# Altium schematic sheet MCU.SchDoc
size A2
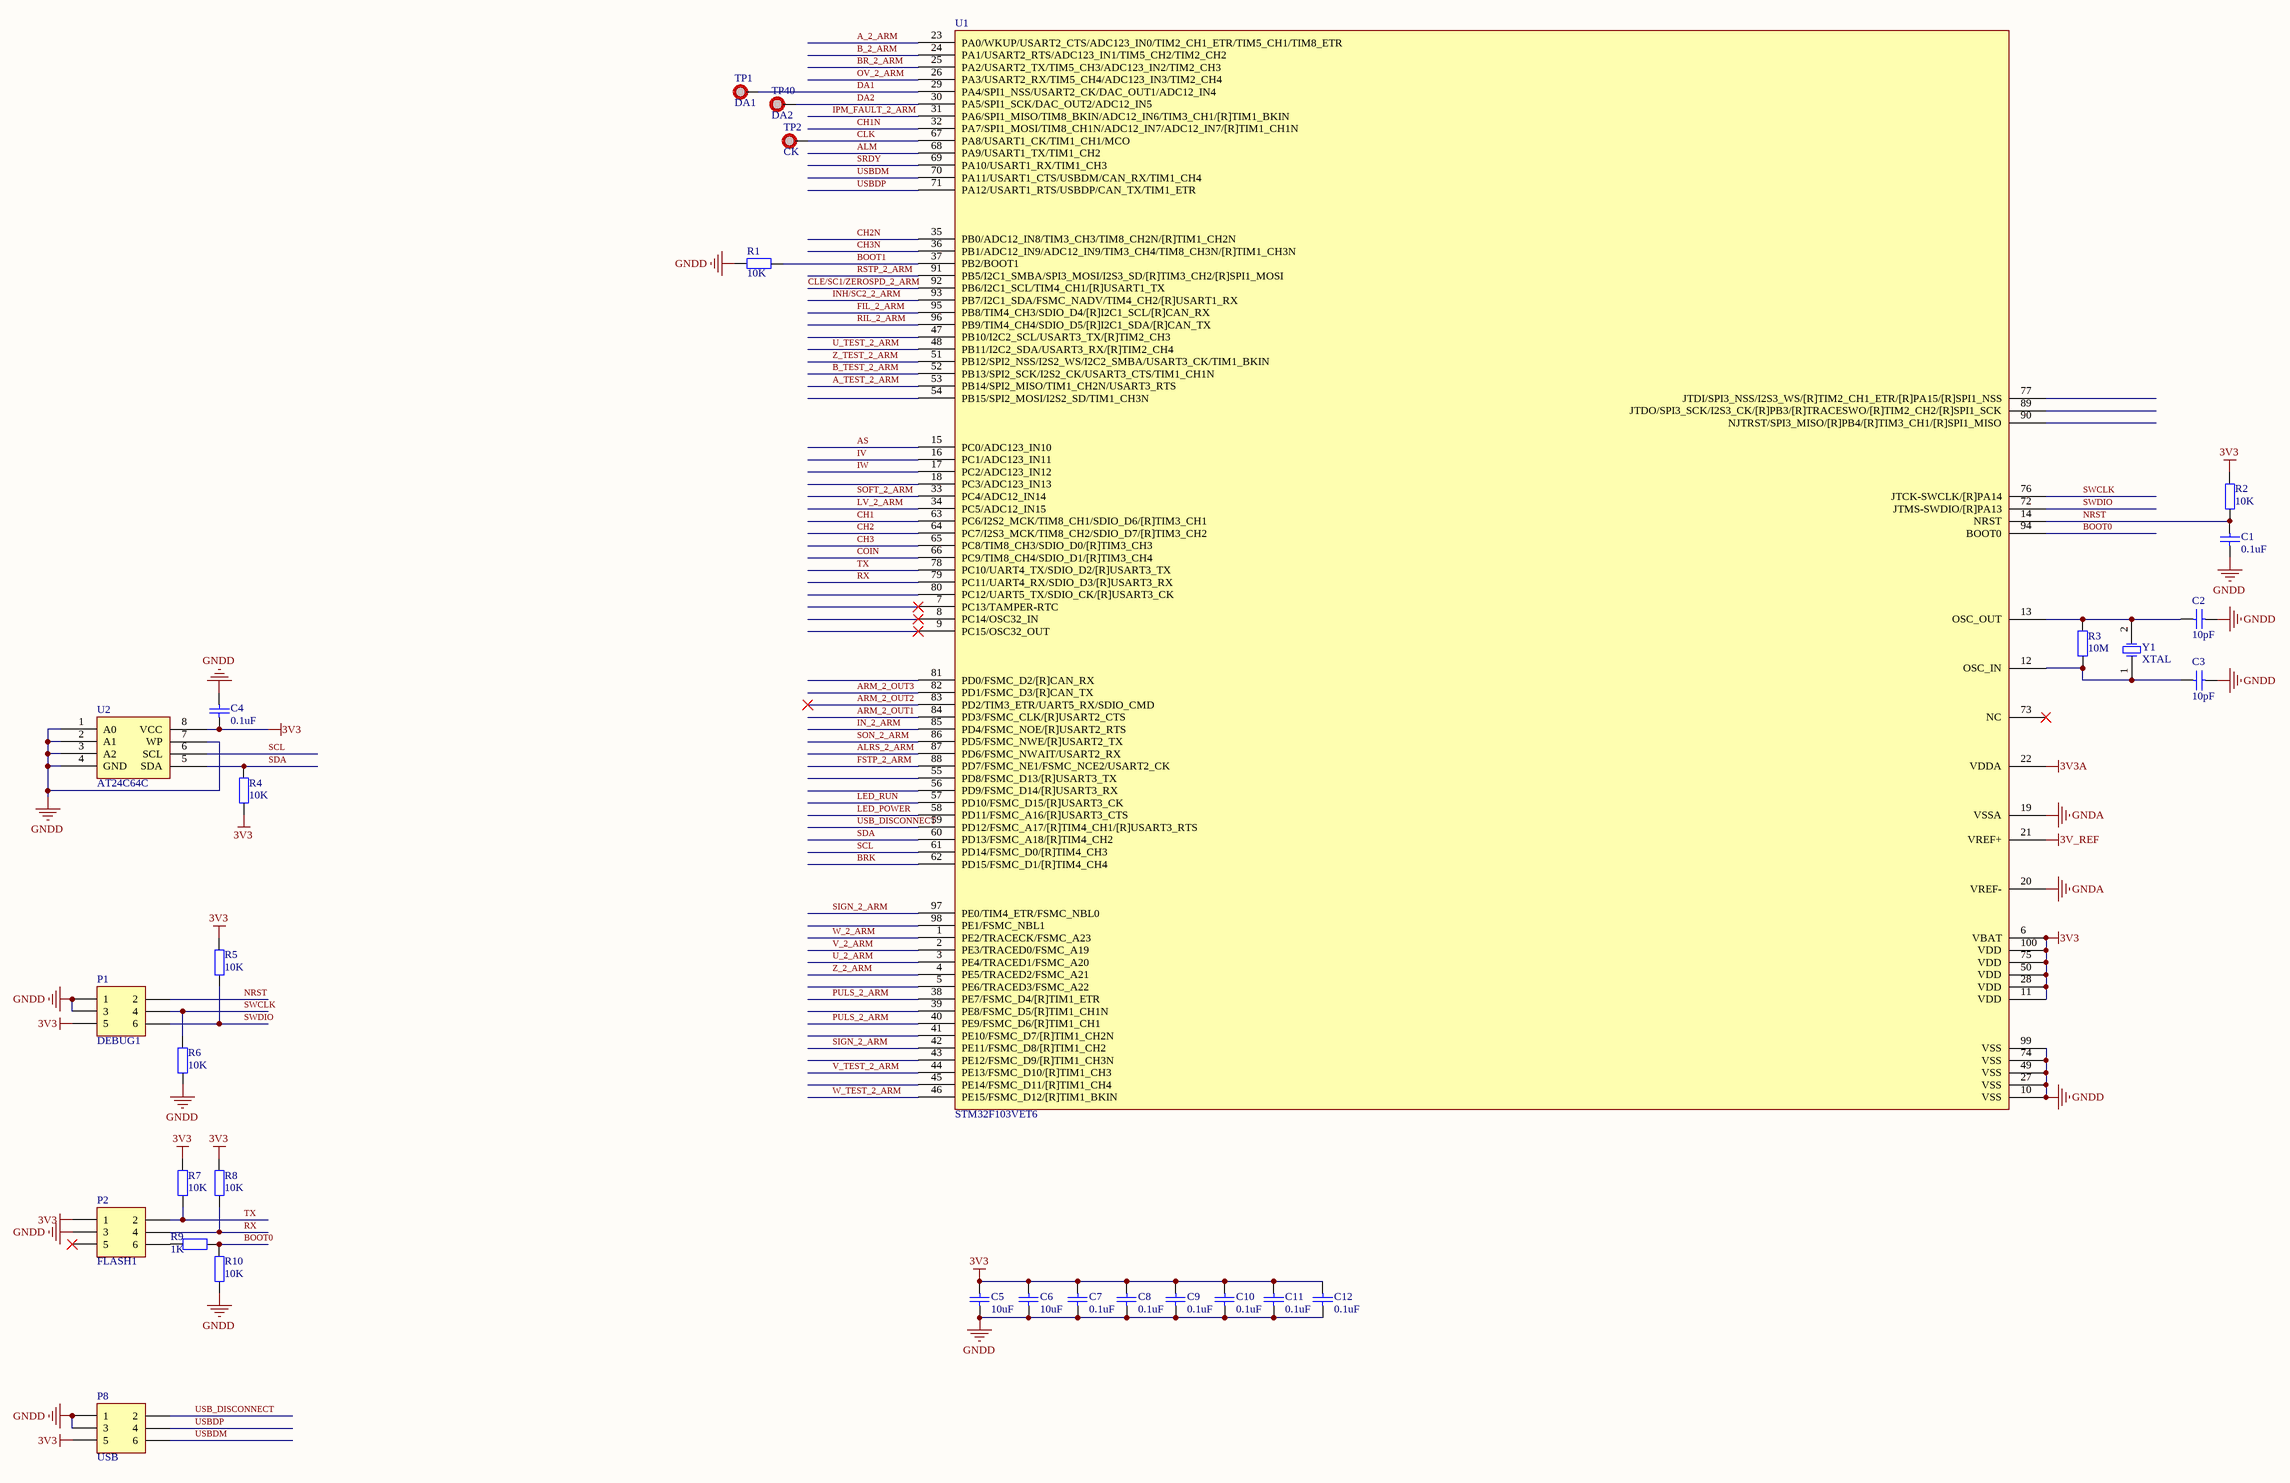
[diagram p0: MCU.SchDoc]

## Parts
C1  0.1uF  [C SMD 0603]
C2  10pF  [C SMD 0603]
C3  10pF  [C SMD 0603]
C4  0.1uF  [C SMD 0603]
C5  10uF  [C SMD 1206]
C6  10uF  [C SMD 1206]
C7  0.1uF  [C SMD 0603]
C8  0.1uF  [C SMD 0603]
C9  0.1uF  [C SMD 0603]
C10  0.1uF  [C SMD 0603]
C11  0.1uF  [C SMD 0603]
C12  0.1uF  [C SMD 0603]
P1  DEBUG1  [2.54 针 3*2]
P2  FLASH1  [2.54 针 3*2]
P8  USB  [2.54 针 3*2]
R1  10K  [R SMD 0603]
R2  10K  [R SMD 0603]
R3  10M  [R SMD 0603]
R4  10K  [R SMD 0603]
R5  10K  [R SMD 0603]
R6  10K  [R SMD 0603]
R7  10K  [R SMD 0603]
R8  10K  [R SMD 0603]
R9  1K  [R SMD 0603]
R10  10K  [R SMD 0603]
TP1  DA1  [测点]
TP2  CK  [测点]
TP40  DA2  [测点]
U1  STM32F103VET6  [LQFP100_L]
U2  AT24C64C  [TSSOP8]
Y1  XTAL  [XTAL]

## Nets
3V3: C4.2 C5.1 C6.1 C7.1 C8.1 C9.1 C10.1 C11.1 C12.1 P1.5 P2.1 P8.5 R2.2 R4.2 R5.2 R7.2 R8.2 U1.6(VBAT) U1.11(VDD) U1.28(VDD) U1.50(VDD) U1.75(VDD) U1.100(VDD) U2.8(VCC)
3V3A: U1.22(VDDA)
3V_REF: U1.21(VREF+)
GNDA: U1.19(VSSA) U1.20(VREF-)
GNDD: C1.2 C2.2 C3.2 C4.1 C5.2 C6.2 C7.2 C8.2 C9.2 C10.2 C11.2 C12.2 P1.1 P1.3 P2.3 P8.1 P8.3 R1.2 R6.1 R10.2 U1.10(VSS) U1.27(VSS) U1.49(VSS) U1.74(VSS) U1.99(VSS) U2.1(A0) U2.2(A1) U2.3(A2) U2.4(GND) U2.7(WP)
A_2_ARM: U1.23(PA0/WKUP/USART2_CTS/ADC123_IN0/TIM2_CH1_ETR/TIM5_CH1/TIM8_ETR)
A_TEST_2_ARM: U1.53(PB14/SPI2_MISO/TIM1_CH2N/USART3_RTS)
ALM: U1.68(PA9/USART1_TX/TIM1_CH2)
ALRS_2_ARM: U1.87(PD6/FSMC_NWAIT/USART2_RX)
ARM_2_OUT1: U1.84(PD3/FSMC_CLK/[R]USART2_CTS)
ARM_2_OUT2: U1.83(PD2/TIM3_ETR/UART5_RX/SDIO_CMD)
ARM_2_OUT3: U1.82(PD1/FSMC_D3/[R]CAN_TX)
AS: U1.15(PC0/ADC123_IN10)
B_2_ARM: U1.24(PA1/USART2_RTS/ADC123_IN1/TIM5_CH2/TIM2_CH2)
B_TEST_2_ARM: U1.52(PB13/SPI2_SCK/I2S2_CK/USART3_CTS/TIM1_CH1N)
BOOT0: R9.1 R10.1 U1.94(BOOT0)
BOOT1: R1.1 U1.37(PB2/BOOT1)
BR_2_ARM: U1.25(PA2/USART2_TX/TIM5_CH3/ADC123_IN2/TIM2_CH3)
BRK: U1.62(PD15/FSMC_D1/[R]TIM4_CH4)
CH1: U1.63(PC6/I2S2_MCK/TIM8_CH1/SDIO_D6/[R]TIM3_CH1)
CH1N: U1.32(PA7/SPI1_MOSI/TIM8_CH1N/ADC12_IN7/ADC12_IN7/[R]TIM1_CH1N)
CH2: U1.64(PC7/I2S3_MCK/TIM8_CH2/SDIO_D7/[R]TIM3_CH2)
CH2N: U1.35(PB0/ADC12_IN8/TIM3_CH3/TIM8_CH2N/[R]TIM1_CH2N)
CH3: U1.65(PC8/TIM8_CH3/SDIO_D0/[R]TIM3_CH3)
CH3N: U1.36(PB1/ADC12_IN9/ADC12_IN9/TIM3_CH4/TIM8_CH3N/[R]TIM1_CH3N)
CLE/SC1/ZEROSPD_2_ARM: U1.92(PB6/I2C1_SCL/TIM4_CH1/[R]USART1_TX)
CLK: TP2.1 U1.67(PA8/USART1_CK/TIM1_CH1/MCO)
COIN: U1.66(PC9/TIM8_CH4/SDIO_D1/[R]TIM3_CH4)
DA1: TP1.1 U1.29(PA4/SPI1_NSS/USART2_CK/DAC_OUT1/ADC12_IN4)
DA2: TP40.1 U1.30(PA5/SPI1_SCK/DAC_OUT2/ADC12_IN5)
FIL_2_ARM: U1.95(PB8/TIM4_CH3/SDIO_D4/[R]I2C1_SCL/[R]CAN_RX)
FSTP_2_ARM: U1.88(PD7/FSMC_NE1/FSMC_NCE2/USART2_CK)
IN_2_ARM: U1.85(PD4/FSMC_NOE/[R]USART2_RTS)
INH/SC2_2_ARM: U1.93(PB7/I2C1_SDA/FSMC_NADV/TIM4_CH2/[R]USART1_RX)
IPM_FAULT_2_ARM: U1.31(PA6/SPI1_MISO/TIM8_BKIN/ADC12_IN6/TIM3_CH1/[R]TIM1_BKIN)
IV: U1.16(PC1/ADC123_IN11)
IW: U1.17(PC2/ADC123_IN12)
LED_POWER: U1.58(PD11/FSMC_A16/[R]USART3_CTS)
LED_RUN: U1.57(PD10/FSMC_D15/[R]USART3_CK)
LV_2_ARM: U1.34(PC5/ADC12_IN15)
NRST: C1.1 P1.2 R2.1 U1.14(NRST)
OV_2_ARM: U1.26(PA3/USART2_RX/TIM5_CH4/ADC123_IN3/TIM2_CH4)
PULS_2_ARM: U1.38(PE7/FSMC_D4/[R]TIM1_ETR) U1.40(PE9/FSMC_D6/[R]TIM1_CH1)
RIL_2_ARM: U1.96(PB9/TIM4_CH4/SDIO_D5/[R]I2C1_SDA/[R]CAN_TX)
RSTP_2_ARM: U1.91(PB5/I2C1_SMBA/SPI3_MOSI/I2S3_SD/[R]TIM3_CH2/[R]SPI1_MOSI)
RX: P2.4 R8.1 U1.79(PC11/UART4_RX/SDIO_D3/[R]USART3_RX)
SCL: U1.61(PD14/FSMC_D0/[R]TIM4_CH3) U2.6(SCL)
SDA: R4.1 U1.60(PD13/FSMC_A18/[R]TIM4_CH2) U2.5(SDA)
SIGN_2_ARM: U1.42(PE11/FSMC_D8/[R]TIM1_CH2) U1.97(PE0/TIM4_ETR/FSMC_NBL0)
SOFT_2_ARM: U1.33(PC4/ADC12_IN14)
SON_2_ARM: U1.86(PD5/FSMC_NWE/[R]USART2_TX)
SRDY: U1.69(PA10/USART1_RX/TIM1_CH3)
SWCLK: P1.4 R6.2 U1.76(JTCK-SWCLK/[R]PA14)
SWDIO: P1.6 R5.1 U1.72(JTMS-SWDIO/[R]PA13)
TX: P2.2 R7.1 U1.78(PC10/UART4_TX/SDIO_D2/[R]USART3_TX)
U_2_ARM: U1.3(PE4/TRACED1/FSMC_A20)
U_TEST_2_ARM: U1.48(PB11/I2C2_SDA/USART3_RX/[R]TIM2_CH4)
USB_DISCONNECT: P8.2 U1.59(PD12/FSMC_A17/[R]TIM4_CH1/[R]USART3_RTS)
USBDM: P8.6 U1.70(PA11/USART1_CTS/USBDM/CAN_RX/TIM1_CH4)
USBDP: P8.4 U1.71(PA12/USART1_RTS/USBDP/CAN_TX/TIM1_ETR)
V_2_ARM: U1.2(PE3/TRACED0/FSMC_A19)
V_TEST_2_ARM: U1.44(PE13/FSMC_D10/[R]TIM1_CH3)
W_2_ARM: U1.1(PE2/TRACECK/FSMC_A23)
W_TEST_2_ARM: U1.46(PE15/FSMC_D12/[R]TIM1_BKIN)
Z_2_ARM: U1.4(PE5/TRACED2/FSMC_A21)
Z_TEST_2_ARM: U1.51(PB12/SPI2_NSS/I2S2_WS/I2C2_SMBA/USART3_CK/TIM1_BKIN)
NetC2_1: C2.1 R3.1 U1.13(OSC_OUT) Y1.2(OSC2)
NetC3_1: C3.1 R3.2 U1.12(OSC_IN) Y1.1(OSC1)
NetP2_6: P2.6 R9.2

Not connected (* = marked no-connect by the designer): P2 5*; U1 5(PE6/TRACED3/FSMC_A22) 7(PC13/TAMPER-RTC)* 8(PC14/OSC32_IN)* 9(PC15/OSC32_OUT)* 18(PC3/ADC123_IN13) 39(PE8/FSMC_D5/[R]TIM1_CH1N) 41(PE10/FSMC_D7/[R]TIM1_CH2N) 43(PE12/FSMC_D9/[R]TIM1_CH3N) 45(PE14/FSMC_D11/[R]TIM1_CH4) 47(PB10/I2C2_SCL/USART3_TX/[R]TIM2_CH3) 54(PB15/SPI2_MOSI/I2S2_SD/TIM1_CH3N) 55(PD8/FSMC_D13/[R]USART3_TX) 56(PD9/FSMC_D14/[R]USART3_RX) 73(NC)* 77(JTDI/SPI3_NSS/I2S3_WS/[R]TIM2_CH1_ETR/[R]PA15/[R]SPI1_NSS) 80(PC12/UART5_TX/SDIO_CK/[R]USART3_CK) 81(PD0/FSMC_D2/[R]CAN_RX) 89(JTDO/SPI3_SCK/I2S3_CK/[R]PB3/[R]TRACESWO/[R]TIM2_CH2/[R]SPI1_SCK) 90(NJTRST/SPI3_MISO/[R]PB4/[R]TIM3_CH1/[R]SPI1_MISO) 98(PE1/FSMC_NBL1)

## Library data of the parts
C1 C4 C7-C12 = Cap: Capacitor; Published: 8-Jun-2000; LatestRevisionDate: 17-Jul-2002; LatestRevisionNote: Re-released for DXP Platform.; PackageReference: RAD-0.3; Publisher: Altium Limited; Value: 0.1uF
  C1 C7-C12: PackageDescription: Radial Cap, Thru-Hole; 2 Leads; 0.3 in Pin Spacing
C2 C3 C5 C6 = Cap: Capacitor; Value: 0.1uF; Published: 8-Jun-2000; LatestRevisionDate: 17-Jul-2002; LatestRevisionNote: Re-released for DXP Platform.; PackageReference: RAD-0.3; Publisher: Altium Limited; PackageDescription: Radial Cap, Thru-Hole; 2 Leads; 0.3 in Pin Spacing
P1 P2 P8 = Header 3X2: Header, 3-Pin, Dual row; LatestRevisionDate: 17-Jul-2002; LatestRevisionNote: Re-released for DXP Platform.; Publisher: Altium Limited
R1-R3 R5-R10 = Res2: Resistor; Value: 1M; Published: 8-Jun-2000; LatestRevisionDate: 17-Jul-2002; LatestRevisionNote: Re-released for DXP Platform.; PackageReference: AXIAL-0.4; Publisher: Altium Limited
R4 = Res2: Resistor; Published: 8-Jun-2000; LatestRevisionDate: 17-Jul-2002; LatestRevisionNote: Re-released for DXP Platform.; PackageReference: AXIAL-0.4; Publisher: Altium Limited; Value: 10K
TP1 TP2 TP40 = TEST_POINT
Y1 = XTAL: Crystal Oscillator; Published: 8-Jun-2000; LatestRevisionDate: 17-Jul-2002; LatestRevisionNote: Re-released for DXP Platform.; PackageReference: R38; Publisher: Altium Limited